# Altium schematic sheet Power.SchDoc
size B; SheetNumber: 5; SheetTotal: 6
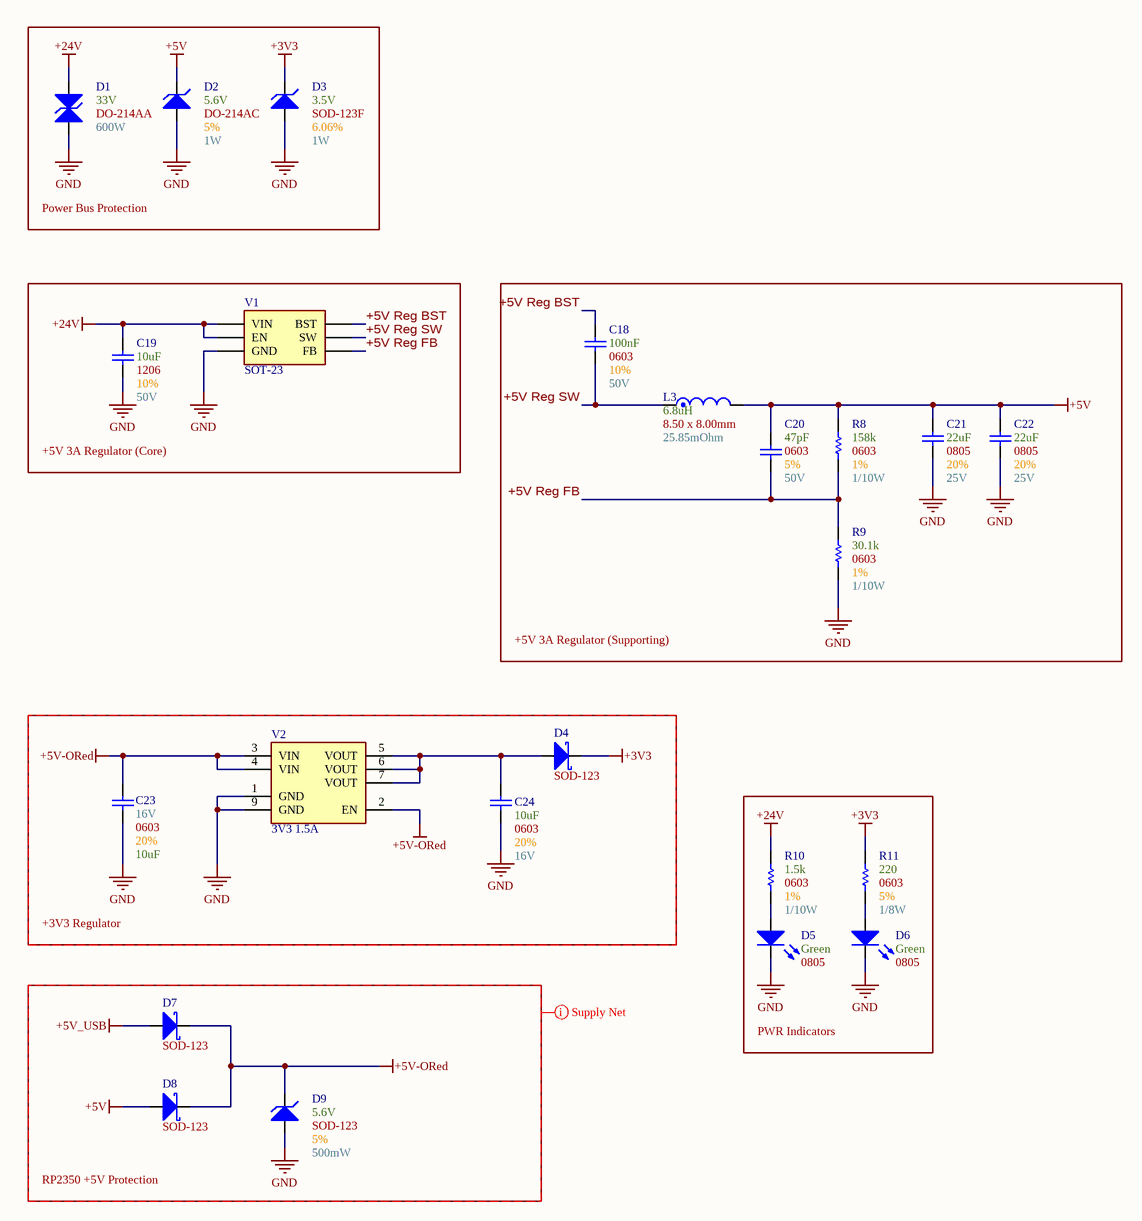
[diagram p0: Power.SchDoc]

## Parts
C18  Max Voltage: 50V  Size Package: 0603  Tolerance: 10%  Capacitance: 100nF  [[Cap] SMD 0603]  (hidden comment: [Cap] 0603 0.1uF 10% 50V)
C19  Max Voltage: 50V  Size Package: 1206  Tolerance: 10%  Capacitance: 10uF  [[Cap] SMD 1206]  (hidden comment: [Cap] 1206 10uF 20% 50V)
C20  Max Voltage: 50V  Size Package: 0603  Tolerance: 5%  Capacitance: 47pF  [[Cap] SMD 0603]  (hidden comment: [Cap] 0603 47pF 5% 50V)
C21  Max Voltage: 25V  Size Package: 0805  Tolerance: 20%  Capacitance: 22uF  [[Cap] SMD 0805]  (hidden comment: [Cap] 0805 22uF 20% 25V)
C22  Max Voltage: 25V  Size Package: 0805  Tolerance: 20%  Capacitance: 22uF  [[Cap] SMD 0805]  (hidden comment: [Cap] 0805 22uF 20% 25V)
C23  Max Voltage: 16V  Size Package: 0603  Tolerance: 20%  Capacitance: 10uF  [[Cap] SMD 0603]  (hidden comment: [Cap] 0603 10uF 20% 16V)
C24  Max Voltage: 16V  Size Package: 0603  Tolerance: 20%  Capacitance: 10uF  [[Cap] SMD 0603]  (hidden comment: [Cap] 0603 10uF 20% 16V)
D1  Wattage: 600W  Optimal Zener Voltage: 33V  [[Diode] SMD DO-214AA]  (hidden comment: DO-214AA)
D2  Tolerance: 5%  Wattage: 1W  Optimal Zener Voltage: 5.6V  [[Diode] SMD DO-214AC]  (hidden comment: DO-214AC)
D3  Tolerance: 6.06%  Wattage: 1W  Optimal Zener Voltage: 3.5V  [[Diode] SOD-123F]  (hidden comment: SOD-123F)
D4  Footprint: SOD-123  [[Diode] SMD SOD-123]  (hidden comment: SOD123)
D5  Color: Green  Size Package: 0805  [[LED] SMD 0805]  (hidden comment: [LED] SMD 0805 Green)
D6  Color: Green  Size Package: 0805  [[LED] SMD 0805]  (hidden comment: [LED] SMD 0805 Green)
D7  Footprint: SOD-123  [[Diode] SMD SOD-123]  (hidden comment: SOD123)
D8  Footprint: SOD-123  [[Diode] SMD SOD-123]  (hidden comment: SOD123)
D9  Tolerance: 5%  Wattage: 500mW  Optimal Zener Voltage: 5.6V  [[Diode] SMD SOD-123]  (hidden comment: SOD-123)
L3  DC Resistance: 25.85mOhm  Package: 8.50 x 8.00mm  Inductance: 6.8uH  [[6.8uH] SMD Nonstandard 6.9A]  (hidden comment: [6.8uH] SMD Nonstandard 6.9A)
R8  Wattage: 1/10W  Tolerance: 1%  Resistance: 158k  Size Package: 0603  [[Res] SMD 0603]  (hidden comment: [158k] SMD 0603 1% 1/10W)
R9  Wattage: 1/10W  Tolerance: 1%  Resistance: 30.1k  Size Package: 0603  [[Res] SMD 0603]  (hidden comment: [30.1k] SMD 0603 1% 1/10W)
R10  Wattage: 1/10W  Tolerance: 1%  Resistance: 1.5k  Size Package: 0603  [[Res] SMD 0603]  (hidden comment: [1.5k] SMD 0603 1% 1/10W)
R11  Wattage: 1/8W  Tolerance: 5%  Resistance: 220  Size Package: 0603  [[Res] SMD 0603]  (hidden comment: [220] SMD 0603 5% 1/10W)
V1  SOT-23  [SOT-23]
V2  3V3 1.5A  [[Linear] 3V3 1.5A]

## Blocks framed on the sheet
Power Bus Protection: D1-D3
+5V 3A Regulator (Core): C19 V1
+5V 3A Regulator (Supporting): C18 C20-C22 L3 R8 R9
+3V3 Regulator: C23 C24 D4 V2
PWR Indicators: D5 D6 R10 R11
RP2350 +5V Protection: D7-D9

## Nets
+3V3: D3.1(K) D4.1(K) R11.2
+5V: C20.2 C21.2 C22.2 D2.1(K) D8.2(A) L3.2 R8.2
+5V-ORed: C23.2 D7.1(K) D8.1(K) D9.1(K) V2.2(EN) V2.3(VIN) V2.4(VIN)
+5V_USB: D7.2(A)
+24V: C19.2 D1.2(K) R10.2 V1.2(EN) V1.3(VIN)
GND: C19.1 C21.1 C22.1 C23.1 C24.1 D1.1(A) D2.2(A) D3.2(A) D5.2(Cathode) D6.2(Cathode) D9.2(A) R9.1 V1.4(GND) V2.1(GND) V2.9(GND)
+5V Reg BST: C18.2 V1.6(BST)
+5V Reg FB: C20.1 R8.1 R9.2 V1.1(FB)
+5V Reg SW: C18.1 L3.1 V1.5(SW)
NetC24_2: C24.2 D4.2(A) V2.5(VOUT) V2.6(VOUT) V2.7(VOUT)
NetD5_1: D5.1(Anode) R10.1
NetD6_1: D6.1(Anode) R11.1

## Layout directives
net class Supply_Nets: +5V, +5V-ORed, +5V_USB, GND

## Library data of the parts
C18 = [Cap] 0603 0.1uF 10% 50V: CL10B104KB8NNNC; Supplier 1: DigiKey; Supplier Part Number 1: 1276-1000-6-ND
C19 = [Cap] 1206 10uF 20% 50V: CGA5L3X5R1H106M160AB; Supplier 1: DigiKey; Supplier Part Number 1: 445-12883-6-ND
C20 = [Cap] 0603 47pF 5% 50V: CL10C470JB8NNNC; Supplier 1: DigiKey; Supplier Part Number 1: 1276-1037-6-ND
C21 C22 = [Cap] 0805 22uF 20% 25V: CL21A226MAYNNWE; Supplier 1: DigiKey; Supplier Part Number 1: 1276-CL21A226MAYNNWECT-ND
C23 C24 = [Cap] 0603 10uF 20% 16V: GRM188C81C106MA73D; Supplier 1: DigiKey; Supplier Part Number 1: 490-7198-1-ND
D1 = [TVS] SMBJ33CA: SMBJ33CA; Supplier 1: DigiKey; Supplier Part Number 1: SMBJ33CA-FDICT-ND; Footprint: DO-214AA
D2 = [Zener] SMD 5.6V 1W 5%: SMAZ5V6-13-F; Supplier 1: DigiKey; Supplier Part Number 1: SMAZ5V6-FDICT-ND; Footprint: DO-214AC
D3 = [Zener] SMD 3.5V 1W 6%: KDZVTR3.3B; Supplier 1: DigiKey; Supplier Part Number 1: 846-KDZVTR3.3BCT-ND; Footprint: SOD-123F
D4 D7 D8 = [Schottky] SMD 40V 1A: B5819W-TP; Supplier 1: DigiKey; Supplier Part Number 1: B5819W-TPMSCT-ND
D5 D6 = [LED] SMD 0805 Green: LG R971-KN-1-0-20-R18; Supplier 1: DigiKey; Supplier Part Number 1: 475-LGR971-KN-1CT-ND
D9 = [Zener] SMD 5.6V 1/2W 5%: CMHZ5232B TR PBFREE; Supplier 1: DigiKey; Footprint: SOD-123; Supplier Part Number 1: 1514-CMHZ5232BTRPBFREEDKR-ND
L3 = [6.8uH] SMD Nonstandard 6.9A: ETQ-P4M6R8KVK; Supplier 1: DigiKey; Supplier Part Number 1: P19775CT-ND
R8 = [158k] SMD 0603 1% 1/10W: RC0603FR-07158KL; Supplier 1: DigiKey; Supplier Part Number 1: 311-158KHRDKR-ND
R9 = [30.1k] SMD 0603 1% 1/10W: RC0603FR-0730K1L; Supplier 1: DigiKey; Supplier Part Number 1: 311-30.1KHRCT-ND
R10 = [1.5k] SMD 0603 1% 1/10W: CR0603-FX-1501ELF; Supplier 1: DigiKey; Supplier Part Number 1: 118-CR0603-FX-1501ELFCT-ND
R11 = [220] SMD 0603 5% 1/10W: RK73B1JTTD221J; Supplier 1: DigiKey; Supplier Part Number 1: 2019-RK73B1JTTD221JDKR-ND
V1 = [Switching] SMD 0.8-31V 3A: AP63301WU-7; Supplier 1: DigiKey; Supplier Part Number 1: 31-AP63301WU-7CT-ND
V2 = [Linear] SMD 3V3 1.5A: AP7362A-33SP-13; Supplier 1: DigiKey; Supplier Part Number 1: AP7362A-33SP-13DICT-ND